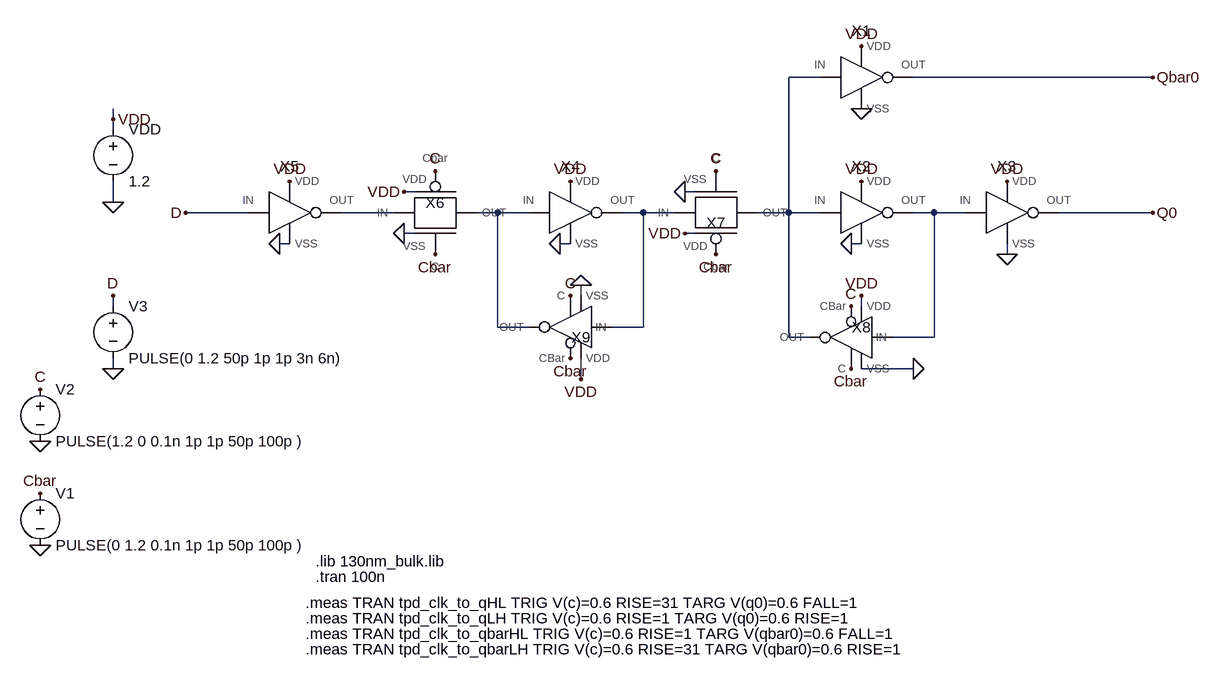
[diagram p0: schematic Prob1.asc]
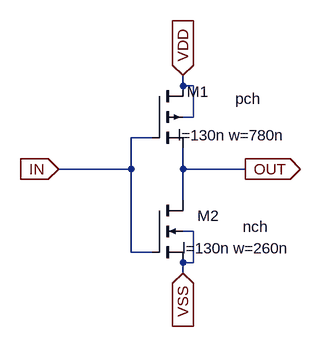
[diagram p1: sub-circuit inverter1.asc]
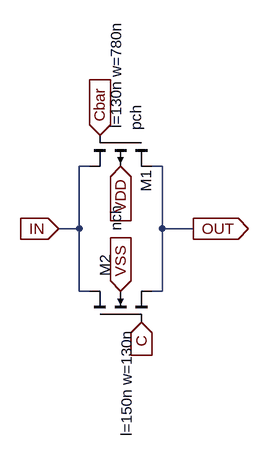
[diagram p2: sub-circuit tg.asc]
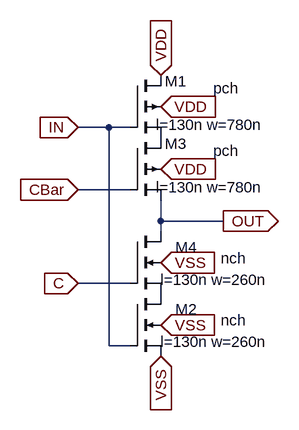
[diagram p3: sub-circuit inverter3state.asc]
Prob1.asc, the LTspice schematic file:
Version 4.1
SHEET 1 3992 680
WIRE 1776 -464 1728 -464
WIRE 2288 -464 1920 -464
WIRE 688 -400 688 -416
WIRE 688 -384 688 -400
WIRE 1152 -288 1136 -288
WIRE 1584 -288 1568 -288
WIRE 688 -272 688 -304
WIRE 896 -256 800 -256
WIRE 1120 -256 1040 -256
WIRE 1280 -256 1248 -256
WIRE 1328 -256 1280 -256
WIRE 1504 -256 1472 -256
WIRE 1552 -256 1504 -256
WIRE 1728 -256 1728 -464
WIRE 1728 -256 1680 -256
WIRE 1776 -256 1728 -256
WIRE 1952 -256 1920 -256
WIRE 2000 -256 1952 -256
WIRE 2288 -256 2144 -256
WIRE 1152 -224 1136 -224
WIRE 1584 -224 1568 -224
WIRE 960 -208 944 -208
WIRE 1392 -208 1376 -208
WIRE 1840 -208 1824 -208
WIRE 2064 -192 2064 -208
WIRE 1408 -128 1408 -144
WIRE 688 -112 688 -128
WIRE 1840 -112 1840 -128
WIRE 1280 -80 1280 -256
WIRE 1328 -80 1280 -80
WIRE 1504 -80 1504 -256
WIRE 1504 -80 1456 -80
WIRE 1728 -64 1728 -256
WIRE 1760 -64 1728 -64
WIRE 1952 -64 1952 -256
WIRE 1952 -64 1888 -64
WIRE 688 -16 688 -32
WIRE 1920 -16 1840 -16
WIRE 1408 0 1408 -32
FLAG 688 -16 0
FLAG 688 -128 D
FLAG 688 -272 0
FLAG 688 -400 VDD
FLAG 944 -208 0
FLAG 1136 -224 0
FLAG 1568 -288 0
FLAG 1376 -208 0
FLAG 1408 -144 0
FLAG 1824 -208 0
FLAG 2064 -192 0
FLAG 1920 -16 0
FLAG 960 -304 VDD
FLAG 1392 -304 VDD
FLAG 1568 -224 VDD
FLAG 1408 0 VDD
FLAG 1840 -128 VDD
FLAG 1840 -304 VDD
FLAG 1840 -512 VDD
FLAG 2064 -304 VDD
FLAG 1136 -288 VDD
FLAG 2288 -464 Qbar0
FLAG 2288 -256 Q0
FLAG 576 96 0
FLAG 576 256 0
FLAG 576 16 C
FLAG 576 176 Cbar
FLAG 1184 -320 C
FLAG 1616 -320 C
FLAG 1392 -128 C
FLAG 1824 -112 C
FLAG 1184 -192 Cbar
FLAG 1616 -192 Cbar
FLAG 1392 -32 Cbar
FLAG 1824 -16 Cbar
FLAG 800 -256 D
FLAG 1840 -416 0
SYMBOL voltage 688 -400 R0
WINDOW 123 0 0 Left 2
WINDOW 39 0 0 Left 2
SYMATTR InstName VDD
SYMATTR Value 1.2
SYMBOL Inverter1 1840 -464 R0
SYMATTR InstName X1
SYMBOL Inverter1 1840 -256 R0
SYMATTR InstName X2
SYMBOL Inverter1 2064 -256 R0
SYMATTR InstName X3
SYMBOL Inverter1 1392 -256 R0
SYMATTR InstName X4
SYMBOL Inverter1 960 -256 R0
SYMATTR InstName X5
SYMBOL TG 1184 -256 R0
SYMATTR InstName X6
SYMBOL TG 1616 -256 M180
SYMATTR InstName X7
SYMBOL Inverter3state 1824 -64 M0
SYMATTR InstName X8
SYMBOL Inverter3state 1392 -80 R180
SYMATTR InstName X9
SYMBOL voltage 576 160 R0
WINDOW 123 0 0 Left 0
WINDOW 39 0 0 Left 0
SYMATTR InstName V1
SYMATTR Value PULSE(0 1.2 0.1n 1p 1p 50p 100p )
SYMBOL voltage 576 0 R0
WINDOW 123 0 0 Left 0
WINDOW 39 0 0 Left 0
SYMATTR InstName V2
SYMATTR Value PULSE(1.2 0 0.1n 1p 1p 50p 100p )
SYMBOL voltage 688 -128 R0
WINDOW 123 0 0 Left 0
WINDOW 39 0 0 Left 0
SYMATTR InstName V3
SYMATTR Value PULSE(0 1.2 50p 1p 1p 3n 6n)
TEXT 1000 280 Left 2 !.lib 130nm_bulk.lib
TEXT 1000 304 Left 2 !.tran 100n
TEXT 984 344 Left 2 !.meas TRAN tpd_clk_to_qHL TRIG V(c)=0.6 RISE=31 TARG V(q0)=0.6 FALL=1
TEXT 984 368 Left 2 !.meas TRAN tpd_clk_to_qLH TRIG V(c)=0.6 RISE=1 TARG V(q0)=0.6 RISE=1
TEXT 984 392 Left 2 !.meas TRAN tpd_clk_to_qbarHL TRIG V(c)=0.6 RISE=1 TARG V(qbar0)=0.6 FALL=1
TEXT 984 416 Left 2 !.meas TRAN tpd_clk_to_qbarLH TRIG V(c)=0.6 RISE=31 TARG V(qbar0)=0.6 RISE=1

inverter1.asc, the sub-circuit schematic file:
Version 4.1
SHEET 1 880 680
WIRE 176 32 176 16
WIRE 192 32 176 32
WIRE 192 80 192 32
WIRE 192 80 176 80
WIRE 128 112 96 112
WIRE 96 160 96 112
WIRE 96 160 -16 160
WIRE 176 160 176 128
WIRE 272 160 176 160
WIRE 176 208 176 160
WIRE 192 256 176 256
WIRE 96 288 96 160
WIRE 128 288 96 288
WIRE 192 304 192 256
WIRE 192 304 176 304
WIRE 176 320 176 304
FLAG -16 160 IN
IOPIN -16 160 In
FLAG 176 16 VDD
IOPIN 176 16 In
FLAG 176 320 VSS
IOPIN 176 320 In
FLAG 272 160 OUT
IOPIN 272 160 Out
SYMBOL pmos4 128 32 R0
WINDOW 0 88 9 Right 2
WINDOW 3 168 20 Right 2
WINDOW 123 206 76 Right 2
SYMATTR InstName M1
SYMATTR Value pch
SYMATTR Value2 l=130n w=780n
SYMBOL nmos4 128 208 R0
WINDOW 0 104 24 Right 2
WINDOW 3 179 41 Right 2
WINDOW 123 213 74 Right 2
SYMATTR InstName M2
SYMATTR Value nch
SYMATTR Value2 l=130n w=260n

tg.asc, the sub-circuit schematic file:
Version 4.1
SHEET 1 2188 680
WIRE 1920 -128 1904 -128
WIRE 2032 -128 2016 -128
WIRE 1904 -32 1904 -128
WIRE 1904 -32 1872 -32
WIRE 2032 -32 2032 -128
WIRE 2080 -32 2032 -32
WIRE 1904 64 1904 -32
WIRE 1920 64 1904 64
WIRE 2032 64 2032 -32
WIRE 2032 64 2016 64
FLAG 1936 -176 Cbar
IOPIN 1936 -176 In
FLAG 2000 112 C
IOPIN 2000 112 In
FLAG 1872 -32 IN
IOPIN 1872 -32 In
FLAG 2080 -32 OUT
IOPIN 2080 -32 Out
FLAG 1968 -128 VDD
IOPIN 1968 -128 In
FLAG 1968 64 VSS
IOPIN 1968 64 In
SYMBOL pmos4 2016 -176 R90
WINDOW 0 88 9 Right 2
WINDOW 3 -7 24 Right 2
WINDOW 123 -10 55 Right 2
SYMATTR InstName M1
SYMATTR Value pch
SYMATTR Value2 l=130n w=780n
SYMBOL nmos4 1920 112 R270
WINDOW 0 104 24 Right 2
WINDOW 3 179 41 Right 2
WINDOW 123 -10 57 Right 2
SYMATTR InstName M2
SYMATTR Value nch
SYMATTR Value2 l=150n w=130n

inverter3state.asc, the sub-circuit schematic file:
Version 4.1
SHEET 1 880 680
WIRE 64 128 16 128
WIRE 96 128 64 128
WIRE 96 224 16 224
WIRE 144 272 144 240
WIRE 240 272 144 272
WIRE 144 288 144 272
WIRE 96 368 16 368
WIRE 64 464 64 128
WIRE 96 464 64 464
FLAG 240 272 OUT
IOPIN 240 272 Out
FLAG 144 48 VDD
IOPIN 144 48 In
FLAG 144 96 VDD
IOPIN 144 96 In
FLAG 144 192 VDD
IOPIN 144 192 In
FLAG 144 480 VSS
IOPIN 144 480 In
FLAG 144 432 VSS
IOPIN 144 432 In
FLAG 144 336 VSS
IOPIN 144 336 In
FLAG 16 224 CBar
IOPIN 16 224 In
FLAG 16 368 C
IOPIN 16 368 In
FLAG 16 128 IN
IOPIN 16 128 In
SYMBOL pmos4 96 48 R0
WINDOW 0 88 9 Right 2
WINDOW 3 168 20 Right 2
WINDOW 123 206 76 Right 2
SYMATTR InstName M1
SYMATTR Value pch
SYMATTR Value2 l=130n w=780n
SYMBOL nmos4 96 384 R0
WINDOW 0 104 24 Right 2
WINDOW 3 179 41 Right 2
WINDOW 123 213 74 Right 2
SYMATTR InstName M2
SYMATTR Value nch
SYMATTR Value2 l=130n w=260n
SYMBOL pmos4 96 144 R0
WINDOW 0 88 9 Right 2
WINDOW 3 168 20 Right 2
WINDOW 123 206 76 Right 2
SYMATTR InstName M3
SYMATTR Value pch
SYMATTR Value2 l=130n w=780n
SYMBOL nmos4 96 288 R0
WINDOW 0 104 24 Right 2
WINDOW 3 179 41 Right 2
WINDOW 123 213 74 Right 2
SYMATTR InstName M4
SYMATTR Value nch
SYMATTR Value2 l=130n w=260n

The netlist it stands for:
* Prob1.asc
VDD VDD 0 1.2
X§X1 N001 VDD 0 Qbar0 inverter1
X§X2 N001 VDD 0 N005 inverter1
X§X3 N005 VDD 0 Q0 inverter1
X§X4 N003 VDD 0 N004 inverter1
X§X5 D VDD 0 N002 inverter1
X§X6 Cbar C N002 VDD 0 N003 tg
X§X7 C Cbar N004 VDD 0 N001 tg
X§X8 Cbar C N005 VDD 0 N001 inverter3state
X§X9 C Cbar N004 VDD 0 N003 inverter3state
V1 Cbar 0 PULSE(0 1.2 0.1n 1p 1p 50p 100p )
V2 C 0 PULSE(1.2 0 0.1n 1p 1p 50p 100p )
V3 D 0 PULSE(0 1.2 50p 1p 1p 3n 6n)

* block symbol definitions
.subckt inverter1 IN VDD VSS OUT
M1 VDD IN OUT VDD pch l=130n w=780n
M2 OUT IN VSS VSS nch l=130n w=260n
.ends inverter1

.subckt tg C Cbar IN VDD VSS OUT
M1 OUT Cbar IN VDD pch l=130n w=780n
M2 IN C OUT VSS nch l=150n w=130n
.ends tg

.subckt inverter3state C CBar IN VDD VSS OUT
M1 VDD IN P001 VDD pch l=130n w=780n
M2 P002 IN VSS VSS nch l=130n w=260n
M3 P001 CBar OUT VDD pch l=130n w=780n
M4 OUT C P002 VSS nch l=130n w=260n
.ends inverter3state

.model NMOS NMOS
.model PMOS PMOS
.lib standard.mos
.lib 130nm_bulk.lib
.tran 100n
.meas TRAN tpd_clk_to_qHL TRIG V(c)=0.6 RISE=31 TARG V(q0)=0.6 FALL=1
.meas TRAN tpd_clk_to_qLH TRIG V(c)=0.6 RISE=1 TARG V(q0)=0.6 RISE=1
.meas TRAN tpd_clk_to_qbarHL TRIG V(c)=0.6 RISE=1 TARG V(qbar0)=0.6 FALL=1
.meas TRAN tpd_clk_to_qbarLH TRIG V(c)=0.6 RISE=31 TARG V(qbar0)=0.6 RISE=1
.backanno
.end